# Altium schematic sheet PowerWaveyRadar.SchDoc: Power WaveyRadar Schematic
size Letter; Author: Will Vu; CompanyName: Raccoon Wireless; DrawnBy: Will Vu, Raccoon Wireless; Engineer: Will Vu; Organization: Raccoon Wireless; DocumentNumber: 2-13; Revision: 2; SheetNumber: 13; SheetTotal: 15
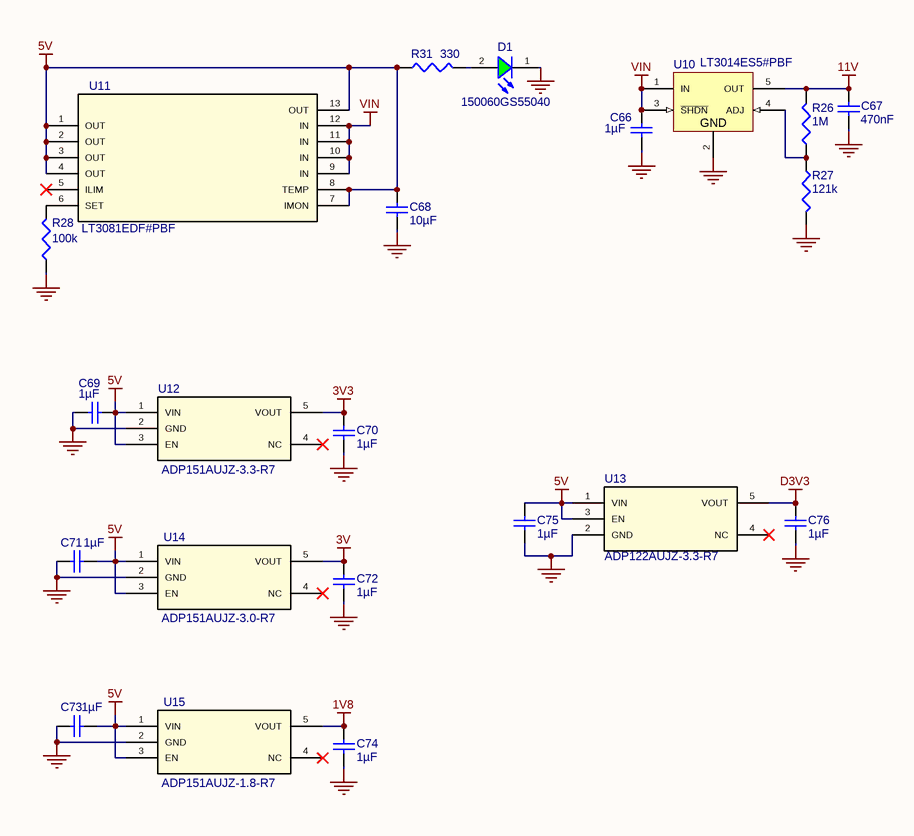
[diagram p0: PowerWaveyRadar.SchDoc]

## Parts
C66  value 1µF  [CAPC0402(1005)60_L]  (hidden comment: Capacitor 1µF +/-20% 10V 0402)
C67  value 470nF  [CAPC0402(1005)60_L]  (hidden comment: Capacitor 470nF +/-40% 10V 0402)
C68  value 10µF  [CAPC0402(1005)60_L]  (hidden comment: Capacitor 10µF +/-40% 6.3V 0402)
C69  value 1µF  [CAPC0402(1005)60_L]  (hidden comment: Capacitor 1µF +/-20% 10V 0402)
C70  value 1µF  [CAPC0402(1005)60_L]  (hidden comment: Capacitor 1µF +/-20% 10V 0402)
C71  value 1µF  [CAPC0402(1005)60_L]  (hidden comment: Capacitor 1µF +/-20% 10V 0402)
C72  value 1µF  [CAPC0402(1005)60_L]  (hidden comment: Capacitor 1µF +/-20% 10V 0402)
C73  value 1µF  [CAPC0402(1005)60_L]  (hidden comment: Capacitor 1µF +/-20% 10V 0402)
C74  value 1µF  [CAPC0402(1005)60_L]  (hidden comment: Capacitor 1µF +/-20% 10V 0402)
C75  value 1µF  [CAPC0402(1005)60_L]  (hidden comment: Capacitor 1µF +/-20% 10V 0402)
C76  value 1µF  [CAPC0402(1005)60_L]  (hidden comment: Capacitor 1µF +/-20% 10V 0402)
D1  150060GS55040  [WL-SMCD_0603]
R26  value 1M  [RESC0402(1005)_L]  (hidden comment: Resistor 1M +/-1 % 0402 63 mW)
R27  value 121k  [RESC0402(1005)_L]  (hidden comment: Resistor 121K +/-1 % 0402 63 mW)
R28  value 100k  [RESC1005X40X25ML05T05]  (hidden comment: Resistor 100k +/-1% 0402 100 mW)
R31  value 330  [RESC0402(1005)_L]  (hidden comment: Resistor 330R +/-5 % 0402 63 mW)
U10  LT3014ES5#PBF  [LT-S5-5-TSOT-23_M]
U11  LT3081EDF#PBF  [DFN-12_DF]
U12  ADP151AUJZ-3.3-R7  [UJ_5]
U13  ADP122AUJZ-3.3-R7  [UJ_5_ADI]
U14  ADP151AUJZ-3.0-R7  [UJ_5]
U15  ADP151AUJZ-1.8-R7  [UJ_5]

## Nets
1V8: C74.1 U15.5(VOUT)
3V: C72.2 U14.5(VOUT)
3V3: C70.1 U12.5(VOUT)
5V: C68.2 C69.1 C71.2 C73.2 C75.2 R31.1 U11.1(OUT) U11.2(OUT) U11.3(OUT) U11.4(OUT) U11.7(IMON) U11.8(TEMP) U11.13(OUT) U12.1(VIN) U12.3(EN) U13.1(VIN) U13.3(EN) U14.1(VIN) U14.3(EN) U15.1(VIN) U15.3(EN)
11V: C67.2 R26.2 U10.5(OUT)
D3V3: C76.2 U13.5(VOUT)
GND: C66.1 C67.1 C68.1 C69.2 C70.2 C71.1 C72.1 C73.1 C74.2 C75.1 C76.1 D1.1(K) R27.2 R28.1 U10.2(GND) U12.2(GND) U13.2(GND) U14.2(GND) U15.2(GND)
VIN: C66.2 U10.1(IN) U10.3(~{SHDN}) U11.9(IN) U11.10(IN) U11.11(IN) U11.12(IN)
NetD1_2: D1.2(A) R31.2
NetR26_1: R26.1 R27.1 U10.4(ADJ)
NetR28_2: R28.2 U11.6(SET)

Not connected (* = marked no-connect by the designer): U11 5(ILIM)*; U12 4(NC)*; U13 4(NC)*; U14 4(NC)*; U15 4(NC)*

## Notes on the sheet
- /

## Library data of the parts
C66 C69-C76 = CMP-001-00063-4: Chip Capacitor, 1µF +/-20%, 10V, 0402, Thickness 0.6 mm; Tolerance: 10%; Max Operating Temperature: 85°C; Mounting Technology: SMT; Pins: 2; Min Operating Temperature: -55°C; Voltage Rating: 10V; Case/Package: 0402
C67 = CMP-001-00060-5: Chip Capacitor, 470nF +/-40%, 10V, 0402, Thickness 0.6 mm; Tolerance: 20%; Pins: 2; Voltage Rating: 10V; Mounting Technology: SMT; Min Operating Temperature: -55°C; Case/Package: 0402; Max Operating Temperature: 85°C
C68 = CMP-001-00074-4: Chip Capacitor, 10µF +/-40%, 6.3V, 0402, Thickness 0.6 mm; Tolerance: 10%; Mounting Technology: SMT; Case/Package: 0402; Pins: 2; Max Operating Temperature: 85°C; Voltage Rating: 6.3V; Min Operating Temperature: -55°C
D1 = CMP-072-000001-1: WL-SMCD SMT Mono-color Chip LED Diffused, size 0603, Green, 3.2V, 140deg; Chip Technology: InGaN; Dominant Wavelength: 525nm; Peak Wavelength: 520nm; Luminous Intensity: 430mcd; Packaging: Tape and Reel; ComponentLink2URL: https://katalog.we-online.de/led/datasheet/150060GS55040.pdf; Design Item ID: 150060GS55040; ComponentLink1URL: http://www.we-online.de; Size: 0603; Published Date: October 2019; Forward Voltage: 3.2V; Viewing Angle: 140deg; ComponentLink1Description: Manufacturer; Operating Temperature: -40 to +85degC; ComponentLink2Description: Datasheet; Mounting Technology: SMT; Emitting Color: Green; Publisher: Wurth Elektronik; Part Number: 150060GS55040; Source: WL-SMCD.SchLib
R26 = CMP-009-00165-4: Chip Resistor, 1 MOhms, +/-1 %, 63 mW, -55 to 155 degC, 0402; Power: 63mW; Tolerance: 1%; Case/Package: 0402; Pins: 2
R27 = CMP-009-00133-4: Chip Resistor, 121 kOhms, +/-1 %, 63 mW, -55 to 155 degC, 0402; Power: 63mW; Tolerance: 1%; Min Operating Temperature: -55°C; Max Operating Temperature: 155°C; Pins: 2; Case/Package: 0402
R28 = CMP-009-00022-6: Chip Resistor, 100 KOhm, +/- 1%, 0.1 W, -55 to 155 degC, 0402 (1005 Metric); Power: 100mW; Voltage Rating: 50V; Mounting Technology: SM; Min Operating Temperature: -55°C; Max Operating Temperature: 155°C; Tolerance: 1%; RoHS Compliant: True; Case/Package: 0402; Pins: 2
R31 = CMP-009-00132-4: Chip Resistor, 330 Ohms, +/-5 %, 63 mW, -55 to 155 degC, 0402; Power: 63mW; Tolerance: 5%; Pins: 2; Max Operating Temperature: 155°C; Min Operating Temperature: -55°C; Case/Package: 0402
U10 = CMP-019-00051-3: LINEAR TECHNOLOGY   LT3014ES5#PBF   LDO Voltage Regulator, Adjustable, 3V to 80V in, 350mV drop, 1.22V to 60V/20mA out, SOT-23-5
U11 = CMP-029-000000-4: No Description Available; Vendor: Linear Technology; Design Item ID: LT3081EDF#PBF; Manufacturer_Part_Number: lt3081edf#pbf; Copyright: Copyright (C) 2018 Accelerated Designs. All rights reserved; RefDes: RefDes; Type: DEV; Source: 2021-06-02_19-29-38.SchLib
U12 = CMP-019-00050-3: Ultralow Noise, 200 mA, CMOS Linear Regulator; VOUT: 3.3v
U13 = CMP-067-000000-1: 5.5 V Input, 300 mA, Low Quiescent Current, CMOS Linear Regulator, Fixed Output Voltage; Built_By: Analog Devices Inc.; Vendor: Analog Devices Inc; SourceLibrary: Analog_2018-03-03; Source: 2021-07-06_01-52-51.SchLib; RefDes: RefDes; Type: DEV; Manufacturer_Part_Number: ADP122AUJZ-3.3-R7; Copyright: Copyright (C) 2021 Accelerated Designs. All rights reserved; Design Item ID: ADP122AUJZ-3.3-R7
U14 = CMP-019-00049-3: Ultralow Noise, 200 mA, CMOS Linear Regulator; VOUT: 3v
U15 = CMP-032-000000-4: Ultralow Noise, 200 mA, CMOS Linear Regulator; VOUT: 1.8v; Source: 2021-06-02_20-26-29.SchLib; Design Item ID: ADP151AUJZ-1.8-R7